# Altium schematic sheet Antenna_Matching_Circuit.SchDoc
size 297 x 209 mm; SheetNumber: 5; SheetTotal: 6
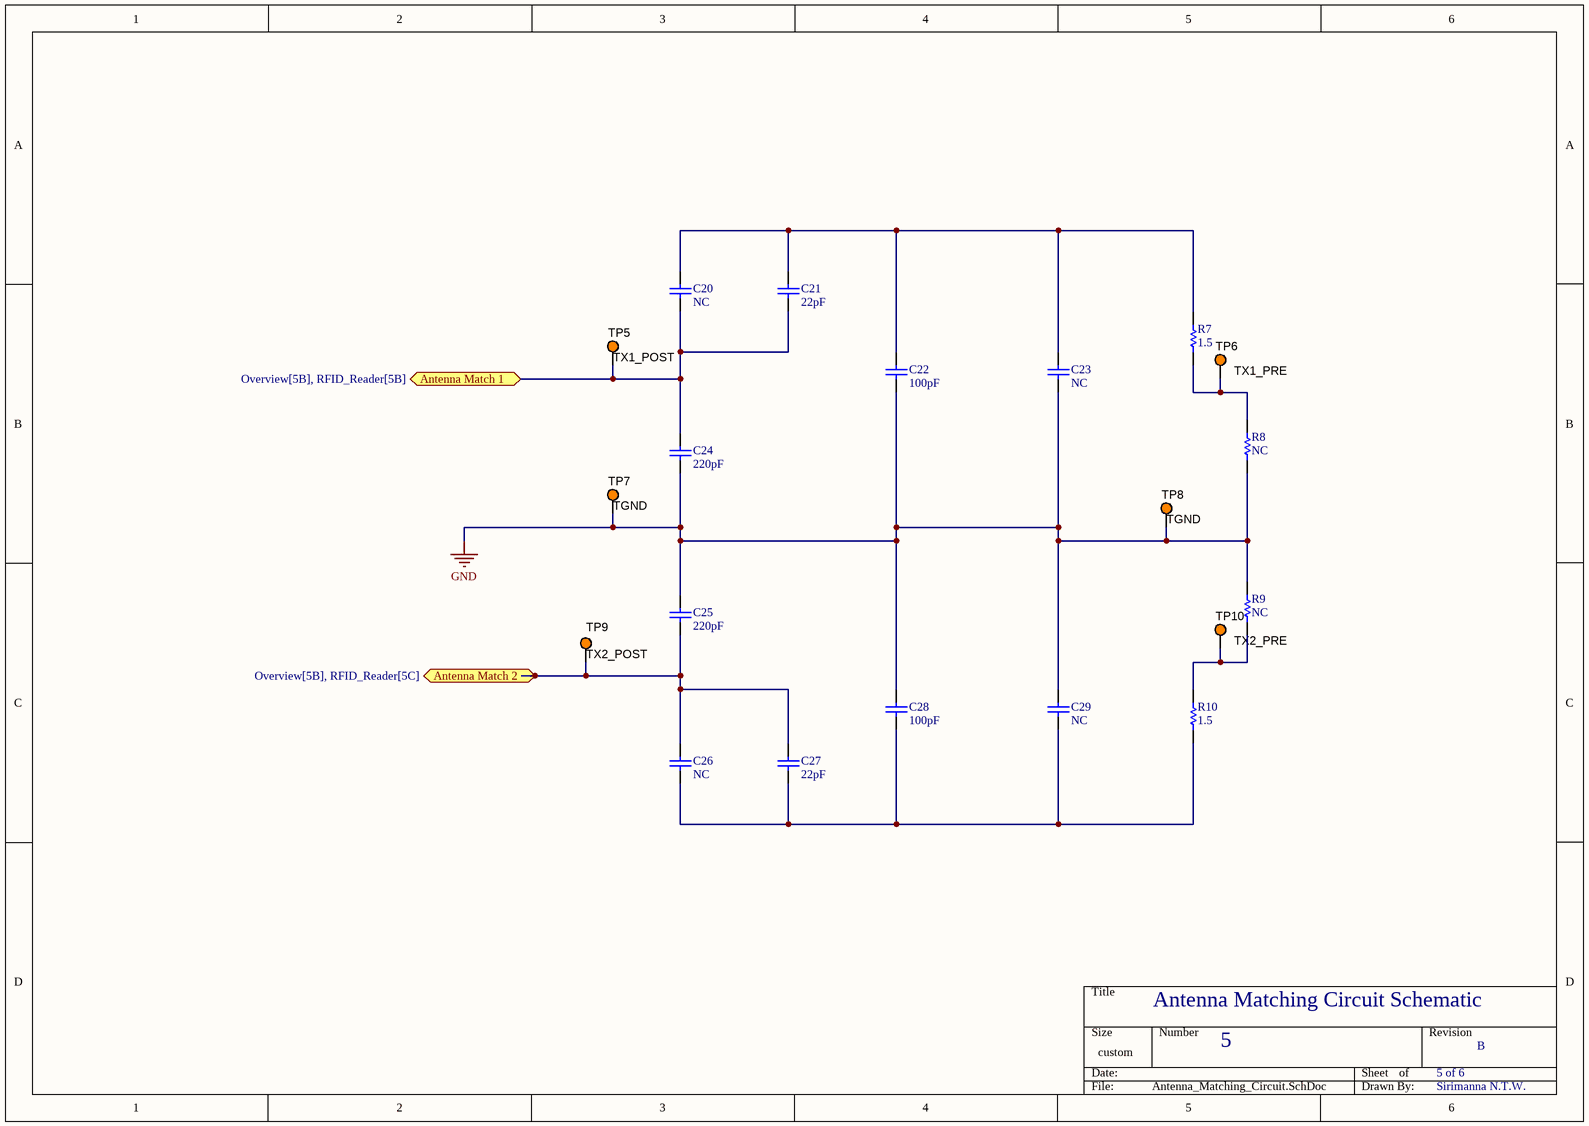
[diagram p0: Antenna_Matching_Circuit.SchDoc]

## Parts
C20  NC  [CAPC2013X135X45NL10T25]
C21  22pF  [CAPC2013X135X45NL10T25]
C22  100pF  [CAPC2013X135X45NL10T25]
C23  NC  [CAPC2013X135X45NL10T25]
C24  220pF  [CAPC2013X135X45NL10T25]
C25  220pF  [CAPC2013X135X45NL10T25]
C26  NC  [CAPC2013X135X45NL10T25]
C27  22pF  [CAPC2013X135X45NL10T25]
C28  100pF  [CAPC2013X135X45NL10T25]
C29  NC  [CAPC2013X135X45NL10T25]
R7  1.5  [RESC2013X70X40NL20T20]
R8  NC  [RESC1005X40X25NL05T05]
R9  NC  [RESC1005X40X25LL05T05]
R10  1.5  [RESC2013X70X40NL20T20]
TP5  TX1_POST  [KSTN-5003]
TP6  TX1_PRE  [KSTN-5003]
TP7  TGND  [KSTN-5003]
TP8  TGND  [KSTN-5003]
TP9  TX2_POST  [KSTN-5003]
TP10  TX2_PRE  [KSTN-5003]

## Ports
Antenna Match 1 (bidir, see Overview[5B], RFID_Reader[5B]), Antenna Match 2 (bidir, see Overview[5B], RFID_Reader[5C])

## Nets
GND: C22.1 C23.1 C24.1 C25.2 C28.2 C29.2 R8.2 R9.1 TP7.1 TP8.1
Antenna Match 1: C20.1 C21.1 C24.2 TP5.1 ; port Antenna Match 1
Antenna Match 2: C25.1 C26.2 C27.2 TP9.1 ; port Antenna Match 2
NetC20_2: C20.2 C21.2 C22.2 C23.2 R7.1
NetC26_1: C26.1 C27.1 C28.1 C29.1 R10.2
NetR7_2: R7.2 R8.1 TP6.1
NetR9_2: R9.2 R10.1 TP10.1

## Notes on the sheet
- Antenna Matching Circuit Schematic
- 5
- 5 of 6
- B
- Sirimanna N.T.W.

## Library data of the parts
C20-C29 = CMP-2100-03644-1: Chip Capacitor, 0.1 uF, +/- 10%, 50 V, -55 to 125 degC, 0805 (2012 Metric), RoHS, Tape and Reel; Manufacturer: Murata; Voltage: 50V; Capacitance: 100nF; Insulation Resistance: 10GR; Dielectric Material: Ceramic; Dielectric: X7R; Package Description: 2-Pin Surface Mount Device, Body 2 x 1.25 mm; Manufacturer URL: http://www.murata.com/; Case Code (Imperial): 0805; Datasheet URL: http://psearch.en.murata.com/capacitor/product/GRM21BR71H104KA01%23.pdf; Termination: SMD/SMT; Lead Free: LeadFree; Package Quantity: 1; Mount: SurfaceMount; REACH SVHC: Unknown; Thickness: 0.053inch; Height: 1.25mm; Case/Package: 0805; Voltage Rating: 50V; Width: 0.049inch; Case Code (Metric): 2012; Material: Ceramic; Min Operating Temperature: -55degC; RoHSCompliant: true; Datasheet Version: 42675.0; Voltage Rating (DC): 50V; Tolerance: 10%; Package Reference: 0805; Depth: 1.25mm; Length: 2mm; Max Operating Temperature: 125degC; Packaging: TapeandReel; Number of Pins: 2; Radiation Hardening: No
R7 R10 = CMP-2001-00490-1: Part Number: ERJ6BQF1R5V; Manufacturer: Panasonic
R8 R9 = CMP-2002-08382-1: Manufacturer: Vishay Dale; Part Number: CRCW040222R0FKED
TP5-TP10 = CMP-1672-00009-1: Test Point, Orange, 1-Pin THD, RoHS; Peak Reverse Current: 600 uA; Forward Current: 3 A; Max Surge Current: 80 A; Forward Voltage: 1.08 V; Max Operating Temperature: 150 degC; PackageReference: 5003; Pins: 2; ComponentLink2URL: http://keyelco.com/userAssets/file/M65p56.pdf; PackageDescription: 1-Pin Through Hole Device, Dia 2.54 mm; Weight: 0.01 lb; Diameter: 5.3 mm; Mount: Through Hole; Package Quantity: 500; Packaging: Bulk; Min Operating Temperature: -65 degC; ComponentLink1Description: Manufacturer URL; Height: 0.25 inch; ComponentLink1URL: http://www.keyelco.com/; ComponentLink2Description: Datasheet; Width: 0.25 inch; REACH SVHC: No SVHC; RoHSCompliant: true; Radiation Hardening: No; Length: 9.5 mm; DatasheetVersion: Jun-15